# Altium schematic sheet Buck_3.3V_line_07.SchDoc
size A3; SheetNumber: 5; SheetTotal: 9
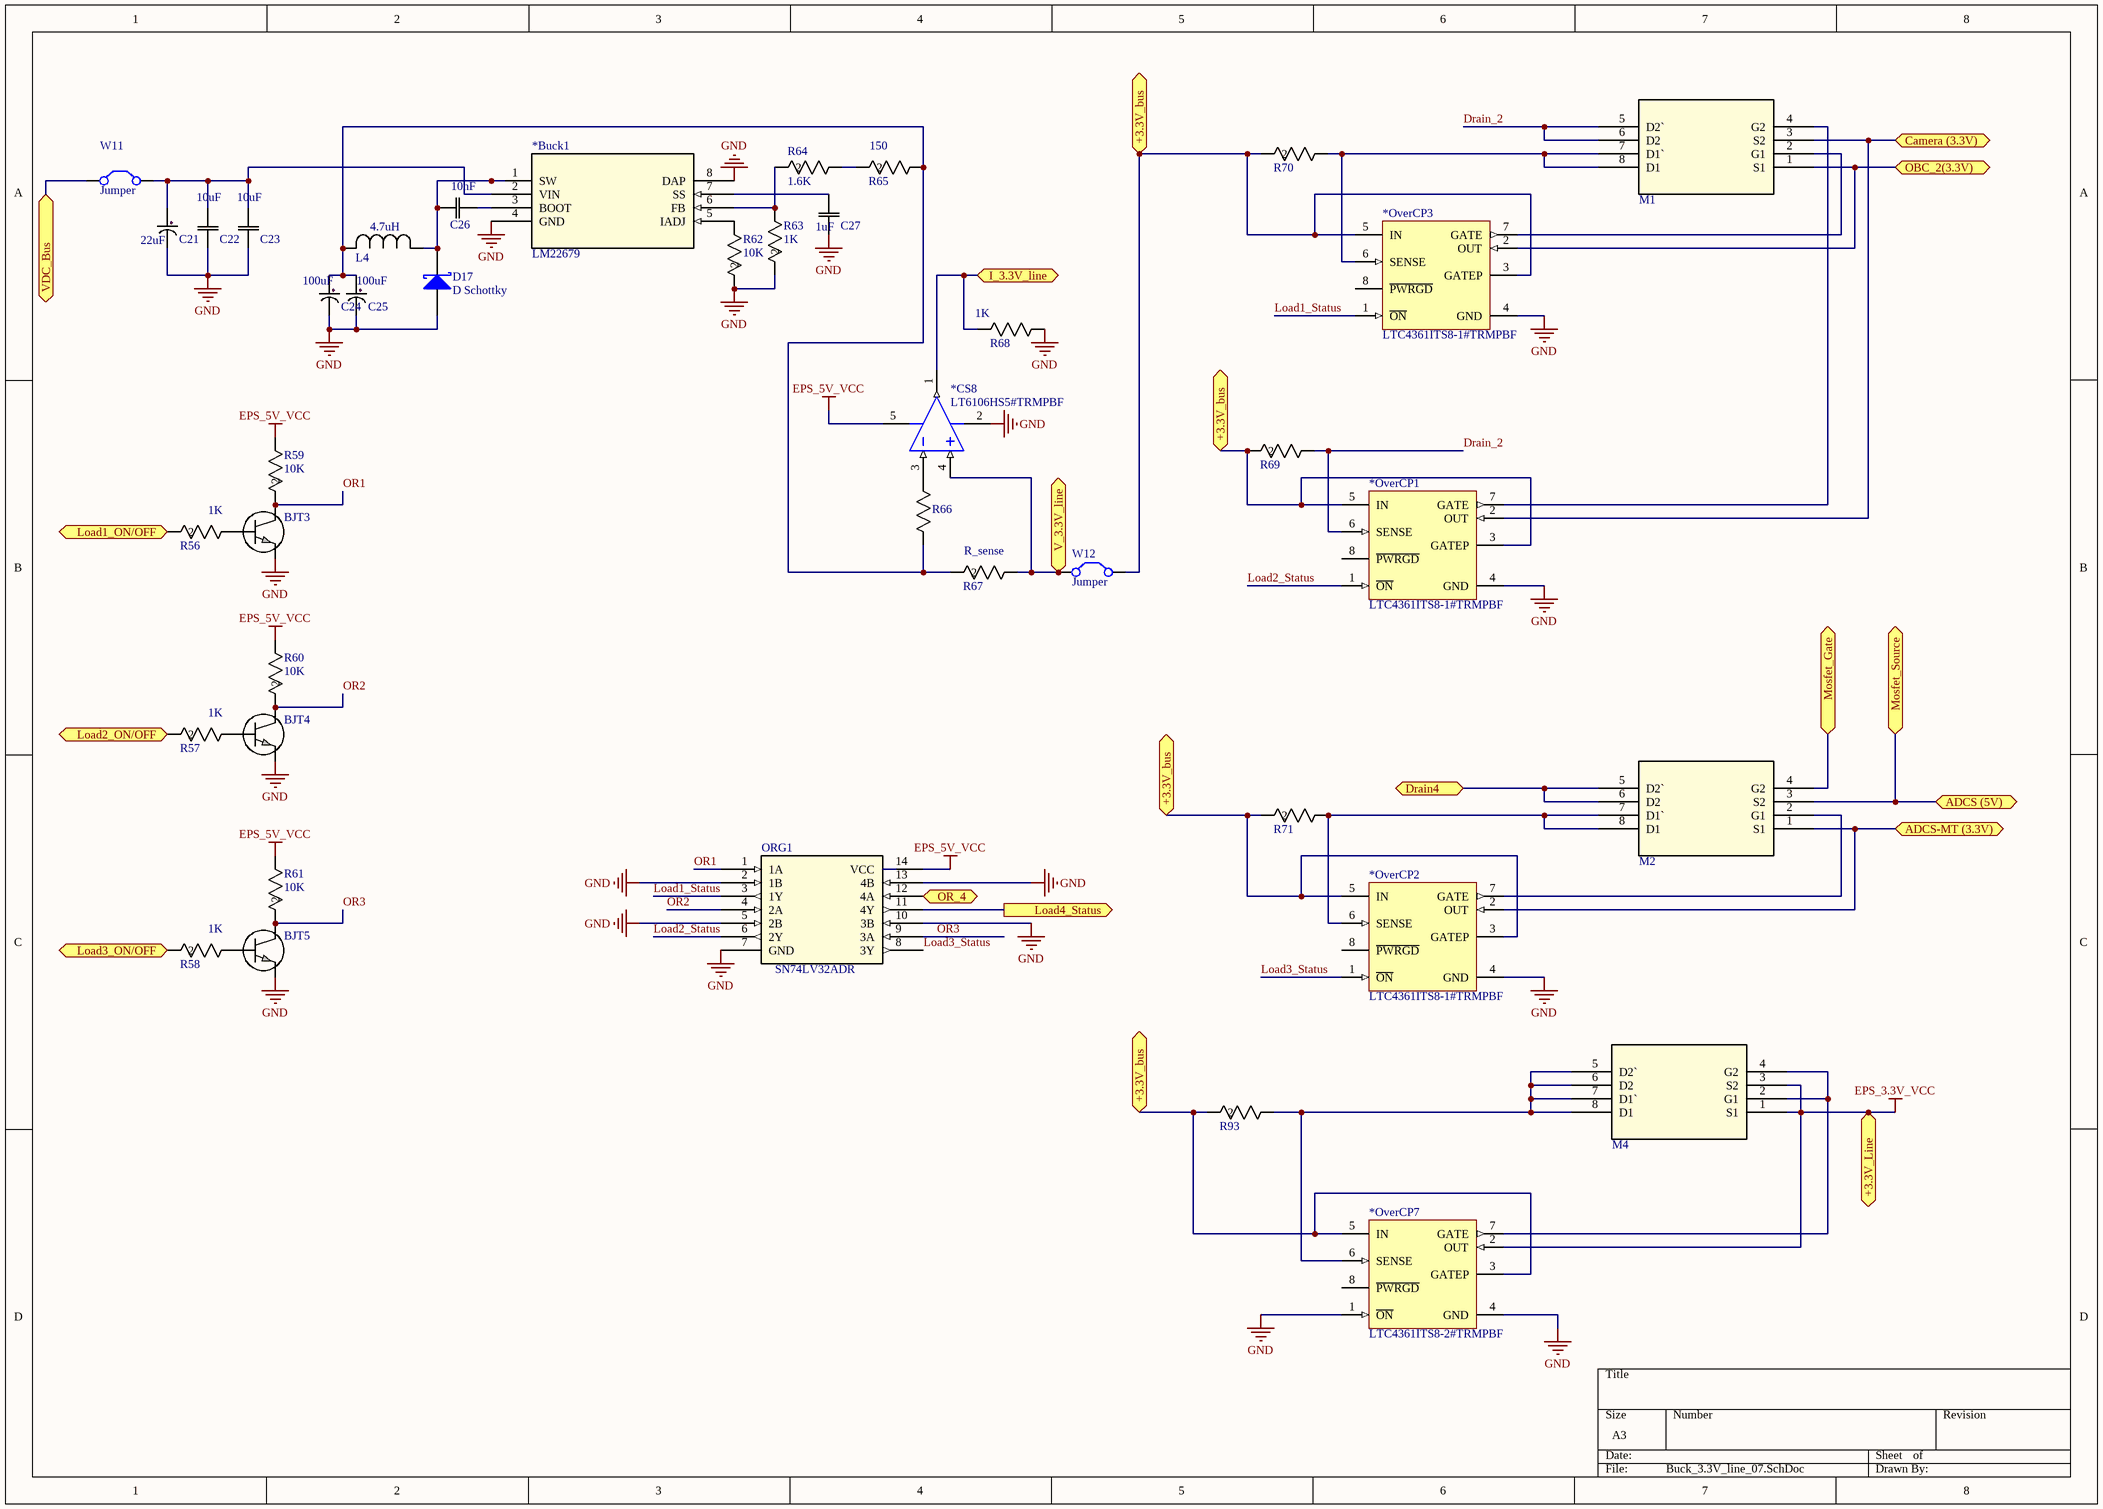
[diagram p0: Buck_3.3V_line_07.SchDoc]

## Parts
*Buck1  LM22679  [TJ7A-M]
*CS8  LT6106HS5#TRMPBF  [LT-S5-5-TSOT-23_N]
*OverCP1  LTC4361ITS8-1#TRMPBF  [LT-TS8-8-TSOT-23_V]
*OverCP2  LTC4361ITS8-1#TRMPBF  [LT-TS8-8-TSOT-23_V]
*OverCP3  LTC4361ITS8-1#TRMPBF  [LT-TS8-8-TSOT-23_V]
*OverCP7  LTC4361ITS8-2#TRMPBF  [LT-TS8-8-TSOT-23_V]
BJT3  MMBT2222A  [SOT-23A_L]  (value not drawn)
BJT4  MMBT2222A  [SOT-23A_L]  (value not drawn)
BJT5  MMBT2222A  [SOT-23A_L]  (value not drawn)
C21  22uF  [TAJB]
C22  10uF  [RC0805N]
C23  10uF  [RC0805N]
C24  100uF  [TAJB]
C25  100uF  [TAJB]
C26  10nF  [RC0805N]
C27  1uF  [RC0805N]
D17  D Schottky  [SMB]
L4  4.7uH  [IND_SPM6530]
M1  IRF7329TRPBF  [SO8_L]  (value not drawn)
M2  IRF7329TRPBF  [SO8_L]  (value not drawn)
M4  IRF7329TRPBF  [SO8_L]  (value not drawn)
ORG1  SN74LV32ADR  [D14-M]
R56  1K  [RC0805N]
R57  1K  [RC0805N]
R58  1K  [RC0805N]
R59  10K  [RC0805N]
R60  10K  [RC0805N]
R61  10K  [RC0805N]
R62  10K  [RC0805N]
R63  1K  [RC0805N]
R64  1.6K  [RC0805N]
R65  150  [RC0805N]
R66  1K  [RC0805N]  (value not drawn)
R67  R_sense  [RC0805N]
R68  1K  [RC0805N]
R69  RL0805FR-070R1L  [RC0805N]  (value not drawn)
R70  RL0805FR-070R1L  [RC0805N]  (value not drawn)
R71  RL0805FR-070R1L  [RC0805N]  (value not drawn)
R93  RL0805FR-070R1L  [RC0805N]  (value not drawn)
W11  Jumper  [RAD-0.1]
W12  Jumper  [RAD-0.1]

## Ports
+3.3V_bus, +3.3V_Line, ADCS (5V), ADCS-MT (3.3V), Camera (3.3V), Drain4, I_3.3V_line, Load1_ON/OFF (in), Load2_ON/OFF (in), Load3_ON/OFF (in), Load4_Status (out), Mosfet_Gate, Mosfet_Source, OBC_2(3.3V), OR_4, V_3.3V_line, VDC_Bus

## Nets
EPS_3.3V_VCC: *OverCP7.2(OUT) M4.1(S1) M4.3(S2) ; port +3.3V_Line
EPS_5V_VCC: *CS8.5(V+) ORG1.14(VCC) R59.1 R60.1 R61.1
GND: *Buck1.4(GND) *Buck1.8(DAP) *CS8.2(V-) *OverCP1.4(GND) *OverCP2.4(GND) *OverCP3.4(GND) *OverCP7.1(~{ON}) *OverCP7.4(GND) BJT3.3(E) BJT4.3(E) BJT5.3(E) C21.2 C22.1 C23.1 C24.2 C25.2 C27.1 D17.1(A) ORG1.2(1B) ORG1.5(2B) ORG1.7(GND) ORG1.10(3B) ORG1.13(4B) R62.2 R63.2 R68.2
+3.3V_bus: *OverCP1.3(GATEP) *OverCP1.5(IN) *OverCP2.3(GATEP) *OverCP2.5(IN) *OverCP3.3(GATEP) *OverCP3.5(IN) *OverCP7.3(GATEP) *OverCP7.5(IN) R69.2 R70.2 R71.2 R93.2 W12.2(C2) ; port +3.3V_bus
ADCS (5V): M2.3(S2) ; port Mosfet_Source, port ADCS (5V)
ADCS-MT (3.3V): *OverCP2.2(OUT) M2.1(S1) ; port ADCS-MT (3.3V)
Camera (3.3V): *OverCP1.2(OUT) M1.3(S2) ; port Camera (3.3V)
Drain4: M2.5(D2`) M2.6(D2) ; port Drain4
Drain_2: *OverCP1.6(SENSE) M1.5(D2`) M1.6(D2) R69.1
I_3.3V_line: *CS8.1(OUT) R68.1 ; port I_3.3V_line
Load1_ON/OFF: R56.2 ; port Load1_ON/OFF
Load1_Status: *OverCP3.1(~{ON}) ORG1.3(1Y)
Load2_ON/OFF: R57.2 ; port Load2_ON/OFF
Load2_Status: *OverCP1.1(~{ON}) ORG1.6(2Y)
Load3_ON/OFF: R58.2 ; port Load3_ON/OFF
Load3_Status: *OverCP2.1(~{ON}) ORG1.8(3Y)
Load4_Status: ORG1.11(4Y) ; port Load4_Status
Mosfet_Gate: M2.4(G2) ; port Mosfet_Gate
OBC_2(3.3V): *OverCP3.2(OUT) M1.1(S1) ; port OBC_2(3.3V)
OR1: BJT3.2(C) ORG1.1(1A) R59.2
OR2: BJT4.2(C) ORG1.4(2A) R60.2
OR3: BJT5.2(C) ORG1.9(3A) R61.2
OR_4: ORG1.12(4A) ; port OR_4
V_3.3V_line: *CS8.4(+IN) R67.1 W12.1(C1) ; port V_3.3V_line
VDC_Bus: W11.1(C1) ; port VDC_Bus
Net*Buck1_1: *Buck1.1(SW) C26.2 D17.2(K) L4.1
Net*Buck1_2: *Buck1.2(VIN) C21.1 C22.2 C23.2 W11.2(C2)
Net*Buck1_3: *Buck1.3(BOOT) C26.1
Net*Buck1_5: *Buck1.5(IADJ) R62.1
Net*Buck1_6: *Buck1.6(FB) R63.1 R64.2
Net*Buck1_7: *Buck1.7(SS) C27.2
Net*CS8_3: *CS8.3(-IN) R66.1
Net*OverCP1_7: *OverCP1.7(GATE) M1.4(G2)
Net*OverCP2_6: *OverCP2.6(SENSE) M2.7(D1`) M2.8(D1) R71.1
Net*OverCP2_7: *OverCP2.7(GATE) M2.2(G1)
Net*OverCP3_6: *OverCP3.6(SENSE) M1.7(D1`) M1.8(D1) R70.1
Net*OverCP3_7: *OverCP3.7(GATE) M1.2(G1)
Net*OverCP7_6: *OverCP7.6(SENSE) M4.5(D2`) M4.6(D2) M4.7(D1`) M4.8(D1) R93.1
Net*OverCP7_7: *OverCP7.7(GATE) M4.2(G1) M4.4(G2)
NetBJT3_1: BJT3.1(B) R56.1
NetBJT4_1: BJT4.1(B) R57.1
NetBJT5_1: BJT5.1(B) R58.1
NetC24_1: C24.1 C25.1 L4.2 R65.1 R66.2 R67.2
NetR64_1: R64.1 R65.2

Not connected (* = marked no-connect by the designer): *OverCP1 8(~{PWRGD}); *OverCP2 8(~{PWRGD}); *OverCP3 8(~{PWRGD}); *OverCP7 8(~{PWRGD})

## Library data of the parts
*Buck1 = LM22679: step down converter; Manufacturer_Part_Number: lm22679tj-adjnopb; Vendor: National Semiconductor; C: Copyright (C) 2015 Accelerated Designs. All rights reserved; Copyright: Copyright (C) 2015 Accelerated Designs. All rights reserved; Value: Value; Type: Type; RefDes: RefDes
*CS8 = LT6106HS5#TRMPBF: Single Channel, Low Cost, High Side Current Sense Operational Amplifier, 0.2 MHz Typical GBW, 5-Pin SOT-23 (S5-5), High Temperature / Automotive, Pb-Free, Mini Reel; Linear Technology Part Number: LT6106; Manufacturer: Linear Technology; Channels (#): 1; GBW (MHz) Typical: 0.2; Is (mA) Typical: 0.06; Vos (mV) Guaranteed: 0.25; Vos (mV) Typical: 0.15; Vs Max (V): 36; Vs Min (V): 2.7; DatasheetVersion: Rev. A; PackageReference: LT-S5-5-TSOT-23; PackageDescription: 5-Lead Plastic TSOT-23, Body 1.63 x 2.90 mm, Pitch 0.95 mm; Supplier 1: Digi-Key; Supplier Part Number 1: LT6106HS5#TRMPBFTR-ND; Supplier 2: Digi-Key; Supplier Part Number 2: LT6106HS5#TRMPBFCT-ND; Supplier 3: Digi-Key; Supplier Part Number 3: LT6106HS5#TRMPBFDKR-ND; Supplier 4: Farnell; Supplier Part Number 4: 1663842; Supplier 5: Farnell; Supplier Part Number 5: 1663842RL; Supplier 6: Newark; Supplier Part Number 6: 57M9138; Packing: Mini Reel; RoHS: Pb-Free; Type: CSA; Mounting Technology: Surface Mount; Code_JEDEC: MO-193; PartNumber: LT6106HS5#TRMPBF; ComponentLink1Description: Manufacturer URL; ComponentLink1URL: http://www.linear.com/; ComponentLink2Description: Datasheet; ComponentLink2URL: http://cds.linear.com/docs/en/datasheet/6106fa.pdf; ComponentLink3Description: Package Specification; ComponentLink3URL: http://cds.linear.com/docs/en/packaging/SOT_5_05-08-1635.pdf
*OverCP1-*OverCP3 *OverCP7 = LTC4361ITS8-1#TRMPBF: Overvoltage / Overcurrent Protection Controller, 2.5 to 80 V Vin, 8-pin SOT23 (TS8-8), -40 to 85 degC, Pb-Free, Mini Tape and Reel; Manufacturer: Linear Technology; Active Limiting: no; Circuit Breaker Accuracy(%): 10; Circuit Breaker Threshold: 50 mV; Circuit Breakers(#): 1; Extended Temp: C, I, H; Power Good: yes; DatasheetVersion: Rev. B; PackageVersion: Rev. A, 08/2010; PackageReference: TS8-8; PackageDescription: 8-Pin Plastic TSOT-23, Body 2.9 x 1.63 mm, Pitch 0.65 mm; Supplier 1: Digi-Key; Supplier Part Number 1: LTC4361ITS8-1#TRMPBFTR-ND; Supplier 2: Digi-Key; Supplier Part Number 2: LTC4361ITS8-1#TRMPBFCT-ND; Supplier 3: Digi-Key; Supplier Part Number 3: LTC4361ITS8-1#TRMPBFDKR-ND; Fast Comparator: no; Fault: no; Foldback: no; Packing: Mini Tape and Reel; Reset: no; RoHS: TRUE; Vin Range: 2.5 to 80 V; Mounting Technology: Surface Mount; Code_JEDEC: MO-193; PartNumber: LTC4361ITS8-1#TRMPBF; ComponentLink1Description: Manufacturer URL; ComponentLink1URL: http://www.linear.com/; ComponentLink2Description: Datasheet; ComponentLink2URL: http://cds.linear.com/docs/en/datasheet/436112fb.pdf; ComponentLink3Description: Package Specification; ComponentLink3URL: http://cds.linear.com/docs/en/packaging/SOT_8_05-08-1637.pdf
BJT3-BJT5 = 2STF1360: BJT; Vendor: ST Microelectronics; Transistor_Type: NPN; Current_-_Collector_(Ic)_(Max): 3A; Voltage_-_Collector_Emitter_Breakdown_(Max): 60V; Vce_Saturation_(Max)_@_Ib,_Ic: 500mV @ 150mA, 3A; DC_Current_Gain_(hFE)_(Min)_@_Ic,_Vce: 160 @ 1A, 2V; Power_-_Max: 1.4W; Frequency_-_Transition: 130MHz; Mounting_Type: Surface Mount; C: Copyright (C) 2015 Accelerated Designs. All rights reserved; Manufacturer_Part_Number: 2STF1360; DigiKeyPartNumber: 497-5211-2-ND; Quantity_Available: 5000; Copyright: Copyright (C) 2015 Accelerated Designs. All rights reserved; DataSheet: http://www.st.com/internet/com/TECHNICAL_RESOURCES/TECHNICAL_LITERATURE/DATASHEET/CD00073146.pdf; Current_-_Collector_Cutoff_(Max): -; Package_/_Case: TO-243AA; Supplier_Device_Package: SOT-89-3; Packaging: Tape &amp; Reel (TR); Value: Value
C21 = TAJB226M010RNJ: Tantalum Capacitor, 22uF; Vendor: AVX Corporation; C: Copyright (C) 2015 Accelerated Designs. All rights reserved; Copyright: Copyright (C) 2015 Accelerated Designs. All rights reserved; Manufacturer_Part_Number: TAJB226M010RNJ; Value: Value; Package/Case: 1411 (3528 metric)
C22 C23 = C0805C106K8PACTU: Ceramic Capacitor 10uF; Vendor: Kemet; Capacitance: 10ÂµF; Voltage_-_Rated: 10V; Tolerance: Â±10%; Temperature_Coefficient: X5R; Operating_Temperature: -55Â°C ~ 85Â°C; Mounting_Type: Surface Mount, MLCC; Thickness_(Max): 0.055" (1.40mm); C: Copyright (C) 2015 Accelerated Designs. All rights reserved; DigiKeyPartNumber: 399-4925-2-ND; Manufacturer_Part_Number: C0805C106K8PACTU; Quantity_Available: 660000; Copyright: Copyright (C) 2015 Accelerated Designs. All rights reserved; DataSheet: http://www.kemet.com/datasheets&amp;C0805C106K8PACTU; Package_/_Case: 0805 (2012 Metric); Packaging: Tape &amp; Reel (TR); Features: -; Lead_Spacing: -; Series: -; Thickness: 1.25mm; NewarkPartNumber: 58M4436; Applications: General Purpose; Ratings: -; Size_/_Dimension: 0.079" L x 0.049" W (2.00mm x 1.25mm); Height_-_Seated_(Max): -; Lead_Style: -; Value: Value
C24 = TAJB226M010RNJ: Tantalum Capacitor. 100uF; Vendor: AVX Corporation; C: Copyright (C) 2015 Accelerated Designs. All rights reserved; Copyright: Copyright (C) 2015 Accelerated Designs. All rights reserved; Manufacturer_Part_Number: TAJB226M010RNJ; Value: Value; Package/Case: 1411 (3528 metric)
C25 = TAJB226M010RNJ: Tantalum Capacitor, 100uF; Vendor: AVX Corporation; C: Copyright (C) 2015 Accelerated Designs. All rights reserved; Copyright: Copyright (C) 2015 Accelerated Designs. All rights reserved; Manufacturer_Part_Number: TAJB226M010RNJ; Value: Value; Package/Case: 1411 (3528 metric)
C26 = GRM155R71H103KA8: Ceramic Capacitor 10nF; Manufacturer_Part_Number: GRM155R71H103KA88D; Vendor: Murata; C: Copyright (C) 2015 Accelerated Designs. All rights reserved; Copyright: Copyright (C) 2015 Accelerated Designs. All rights reserved; Value: Value
C27 = GRM188R61C105KA9: Ceramic Capacitor 1uF; Manufacturer_Part_Number: GRM188R61C105KA93D; Vendor: Murata; C: Copyright (C) 2015 Accelerated Designs. All rights reserved; Copyright: Copyright (C) 2015 Accelerated Designs. All rights reserved; Value: Value; Package/Case: 0603 (1608 Metric)
D17 = D Schottky: Schottky Diode, 3A; Published: 8-Jun-2000; LatestRevisionDate: 17-Jul-2002; LatestRevisionNote: Re-released for DXP Platform.; PackageReference: SMB; Publisher: Altium Limited; PackageDescription: DO-214-AA/SMB; 2 C-Bend Leads; Body 5.3 x 3.6 mm, inc. leads (LxW); Code_JEDEC: DO-214-AA
L4 = SPM6530T-4R7M: Inductor, 4.7uH; Vendor: TDK; C: Copyright (C) 2015 Accelerated Designs. All rights reserved; Manufacturer_Part_Number: SPM6530T-4R7M; Copyright: Copyright (C) 2015 Accelerated Designs. All rights reserved; Value: Value
M1 M2 M4 = IRF7329TRPBF: P-MOSFET, DUAL PCh -12V 9.2A; Manufacturer: Infineon / IR; Number of Channels: 2 Channels; Manufacturer Part No: IRF7329TRPBF; Package/Case: SO-8; Mouser Part No: 942-IRF7329TRPBF
ORG1 = SN74LV32ADR: OR GATE, 4 Channels; Manufacturer: Texas Instruments; INDUSTRY_STD_PKG_TYPE: SOIC; FAMILY_NAME: OR GATE; PIN_COUNT: 14; PACKAGE_DESIGNATOR: D; 3D_Library_Name: TI_AllParts_2012-12-25; C: Copyright (C) 2015 Accelerated Designs. All rights reserved; Datasheet_URL: http://www.ti.com/lit/gpn/SN74LV32A; Copyright: Copyright (C) 2015 Accelerated Designs. All rights reserved; GENERIC_PART_NUMBER: SN74LV32A; Vendor: Texas Instruments; Manufacturer_Part_Number: SN74LV32ADR; Value: Value; Type: Type; RefDes: RefDes
R56-R58 R63 = RC0805FR: Thick Film Resistors, 1k ohm; Manufacturer_Part_Number: RC0805FR-074K7L; Vendor: Yageo; Resistance_In_Ohms: 4.70K; Power_(Watts): 0.125W, 1/8W; Tolerance: Â±1%; Lead_Style: Surface Mount (SMD - SMT); Voltage_-_Working: 150V; Temperature_Coefficient: Â±100ppm/Â°C; Resistance_(Ohms): 4.7K; Number_of_Terminations: 2; C: Copyright (C) 2015 Accelerated Designs. All rights reserved; DigiKeyPartNumber: 311-4.70KCRTR-ND; Quantity_Available: 0; Copyright: Copyright (C) 2015 Accelerated Designs. All rights reserved; DataSheet: http://www.yageo.com/documents/recent/PYu-RC0805_51_RoHS_L_4.pdf; Case: 0805 (2012 metric); Packaging: Tape &amp; Reel (TR); Composition: Thick Film; NewarkPartNumber: 10R0398; Features: -; Package_/_Case: 0805 (2012 Metric); Size_/_Dimension: 0.079" L x 0.049" W (2.00mm x 1.25mm); Height: 0.024" (0.60mm); Value: Value
R59-R61 = RC0805FR: Thick Film Resistors, 10k ohm; Manufacturer_Part_Number: RC0805FR-074K7L; Vendor: Yageo; Resistance_In_Ohms: 4.70K; Power_(Watts): 0.125W, 1/8W; Tolerance: Â±1%; Lead_Style: Surface Mount (SMD - SMT); Voltage_-_Working: 150V; Temperature_Coefficient: Â±100ppm/Â°C; Resistance_(Ohms): 4.7K; Number_of_Terminations: 2; C: Copyright (C) 2015 Accelerated Designs. All rights reserved; DigiKeyPartNumber: 311-4.70KCRTR-ND; Quantity_Available: 0; Copyright: Copyright (C) 2015 Accelerated Designs. All rights reserved; DataSheet: http://www.yageo.com/documents/recent/PYu-RC0805_51_RoHS_L_4.pdf; Case: 0805 (2012 metric); Packaging: Tape &amp; Reel (TR); Composition: Thick Film; NewarkPartNumber: 10R0398; Features: -; Package_/_Case: 0805 (2012 Metric); Size_/_Dimension: 0.079" L x 0.049" W (2.00mm x 1.25mm); Height: 0.024" (0.60mm); Value: Value
R62 = RC0805FR: Thick Film Resistors 10k ohm; Manufacturer_Part_Number: RC0805FR-074K7L; Vendor: Yageo; Resistance_In_Ohms: 4.70K; Power_(Watts): 0.125W, 1/8W; Tolerance: Â±1%; Lead_Style: Surface Mount (SMD - SMT); Voltage_-_Working: 150V; Temperature_Coefficient: Â±100ppm/Â°C; Resistance_(Ohms): 4.7K; Number_of_Terminations: 2; C: Copyright (C) 2015 Accelerated Designs. All rights reserved; DigiKeyPartNumber: 311-4.70KCRTR-ND; Quantity_Available: 0; Copyright: Copyright (C) 2015 Accelerated Designs. All rights reserved; DataSheet: http://www.yageo.com/documents/recent/PYu-RC0805_51_RoHS_L_4.pdf; Case: 0805 (2012 metric); Packaging: Tape &amp; Reel (TR); Composition: Thick Film; NewarkPartNumber: 10R0398; Features: -; Package_/_Case: 0805 (2012 Metric); Size_/_Dimension: 0.079" L x 0.049" W (2.00mm x 1.25mm); Height: 0.024" (0.60mm); Value: Value
R64 = RC0805FR: Thick Film Resistors, 1.6kohm; Manufacturer_Part_Number: RC0805FR-074K7L; Vendor: Yageo; Resistance_In_Ohms: 4.70K; Power_(Watts): 0.125W, 1/8W; Tolerance: Â±1%; Lead_Style: Surface Mount (SMD - SMT); Voltage_-_Working: 150V; Temperature_Coefficient: Â±100ppm/Â°C; Resistance_(Ohms): 4.7K; Number_of_Terminations: 2; C: Copyright (C) 2015 Accelerated Designs. All rights reserved; DigiKeyPartNumber: 311-4.70KCRTR-ND; Quantity_Available: 0; Copyright: Copyright (C) 2015 Accelerated Designs. All rights reserved; DataSheet: http://www.yageo.com/documents/recent/PYu-RC0805_51_RoHS_L_4.pdf; Case: 0805 (2012 metric); Packaging: Tape &amp; Reel (TR); Composition: Thick Film; NewarkPartNumber: 10R0398; Features: -; Package_/_Case: 0805 (2012 Metric); Size_/_Dimension: 0.079" L x 0.049" W (2.00mm x 1.25mm); Height: 0.024" (0.60mm); Value: Value
R65 = RC0805FR: Thick Film Resistors, 150 ohm; Manufacturer_Part_Number: RC0805FR-074K7L; Vendor: Yageo; Resistance_In_Ohms: 4.70K; Power_(Watts): 0.125W, 1/8W; Tolerance: Â±1%; Lead_Style: Surface Mount (SMD - SMT); Voltage_-_Working: 150V; Temperature_Coefficient: Â±100ppm/Â°C; Resistance_(Ohms): 4.7K; Number_of_Terminations: 2; C: Copyright (C) 2015 Accelerated Designs. All rights reserved; DigiKeyPartNumber: 311-4.70KCRTR-ND; Quantity_Available: 0; Copyright: Copyright (C) 2015 Accelerated Designs. All rights reserved; DataSheet: http://www.yageo.com/documents/recent/PYu-RC0805_51_RoHS_L_4.pdf; Case: 0805 (2012 metric); Packaging: Tape &amp; Reel (TR); Composition: Thick Film; NewarkPartNumber: 10R0398; Features: -; Package_/_Case: 0805 (2012 Metric); Size_/_Dimension: 0.079" L x 0.049" W (2.00mm x 1.25mm); Height: 0.024" (0.60mm); Value: Value
R66 = RC0805FR: Thick Film Resistors 0805; Manufacturer_Part_Number: RC0805FR-074K7L; Vendor: Yageo; Power_(Watts): 0.125W, 1/8W; Tolerance: Â±1%; Lead_Style: Surface Mount (SMD - SMT); Voltage_-_Working: 150V; Temperature_Coefficient: Â±100ppm/Â°C; Number_of_Terminations: 2; C: Copyright (C) 2015 Accelerated Designs. All rights reserved; DigiKeyPartNumber: 311-4.70KCRTR-ND; Quantity_Available: 0; Copyright: Copyright (C) 2015 Accelerated Designs. All rights reserved; DataSheet: http://www.yageo.com/documents/recent/PYu-RC0805_51_RoHS_L_4.pdf; Resistance_In_Ohms: 1K; Case: 0805 (2012 metric); Packaging: Tape &amp; Reel (TR); Composition: Thick Film; NewarkPartNumber: 10R0398; Resistance_(Ohms): 1K; Features: -; Package_/_Case: 0805 (2012 Metric); Size_/_Dimension: 0.079" L x 0.049" W (2.00mm x 1.25mm); Height: 0.024" (0.60mm); Value: Value
R67 R69-R71 R93 = RL0805FR-070R1L: Sense Resistor 100m ohm 0805; Vendor: Yageo; Resistance_In_Ohms: 0.10; Power_(Watts): 0.125W, 1/8W; Tolerance: Â±1%; Lead_Style: Surface Mount (SMD - SMT); Voltage_-_Working: 300V; Temperature_Coefficient: Â±600ppm/Â°C; Resistance_(Ohms): 0.1; Number_of_Terminations: 2; C: Copyright (C) 2015 Accelerated Designs. All rights reserved; DigiKeyPartNumber: 311-.10STR-ND; Manufacturer_Part_Number: RL0805FR-070R1L; Quantity_Available: 25000; Copyright: Copyright (C) 2015 Accelerated Designs. All rights reserved; DataSheet: http://www.yageo.com/documents/recent/PYu-RL_521_RoHS_L_5.pdf; Case: 0805 (2012 metric); Packaging: Tape &amp; Reel (TR); Composition: Thick Film; NewarkPartNumber: 66R6321; Features: Current Sense; Package_/_Case: 0805 (2012 Metric); Size_/_Dimension: 0.079" L x 0.049" W (2.00mm x 1.25mm); Height: 0.024" (0.60mm); Value: Value
R68 = RC0805FR: Thick Film Resistors 0805; Manufacturer_Part_Number: RC0805FR-074K7L; Vendor: Yageo; Resistance_In_Ohms: 4.70K; Power_(Watts): 0.125W, 1/8W; Tolerance: Â±1%; Lead_Style: Surface Mount (SMD - SMT); Voltage_-_Working: 150V; Temperature_Coefficient: Â±100ppm/Â°C; Resistance_(Ohms): 4.7K; Number_of_Terminations: 2; C: Copyright (C) 2015 Accelerated Designs. All rights reserved; DigiKeyPartNumber: 311-4.70KCRTR-ND; Quantity_Available: 0; Copyright: Copyright (C) 2015 Accelerated Designs. All rights reserved; DataSheet: http://www.yageo.com/documents/recent/PYu-RC0805_51_RoHS_L_4.pdf; Case: 0805 (2012 metric); Packaging: Tape &amp; Reel (TR); Composition: Thick Film; NewarkPartNumber: 10R0398; Features: -; Package_/_Case: 0805 (2012 Metric); Size_/_Dimension: 0.079" L x 0.049" W (2.00mm x 1.25mm); Height: 0.024" (0.60mm); Value: Value
W11 W12 = Jumper: Jumper Wire; Published: 24-Mar-1999; LatestRevisionDate: 17-Jul-2002; LatestRevisionNote: Re-released for DXP Platform.; PackageReference: RAD-0.2; Publisher: Altium Limited; PackageDescription: Radial Cap, Thru-Hole; 2 Leads; 0.2 in Pin Spacing